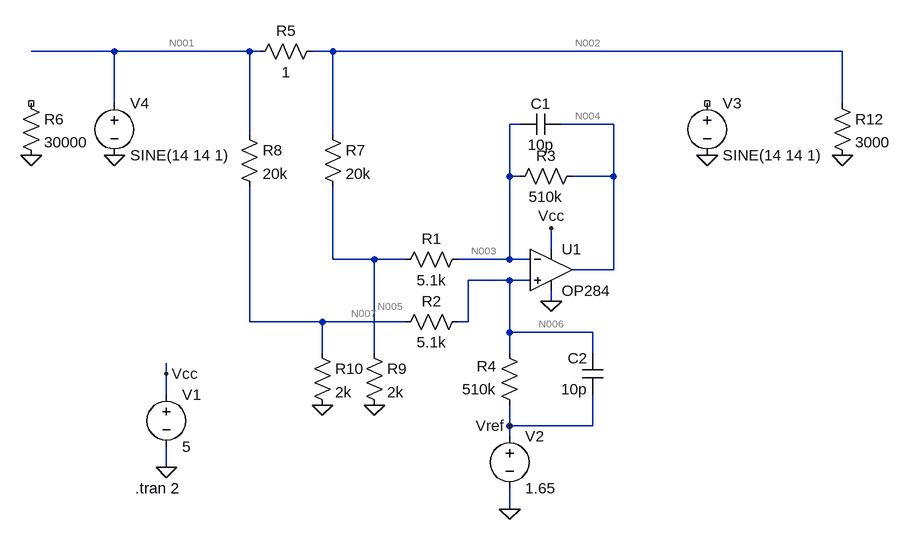
[diagram p0: schematic Diff_OAMP_0.asc]
Diff_OAMP_0.asc, the LTspice schematic file:
Version 4
SHEET 1 884 680
WIRE -464 -176 -592 -176
WIRE -256 -176 -464 -176
WIRE -240 -176 -256 -176
WIRE -128 -176 -160 -176
WIRE 656 -176 -128 -176
WIRE -464 -96 -464 -176
WIRE 656 -96 656 -176
WIRE 160 -64 144 -64
WIRE 304 -64 224 -64
WIRE -256 -48 -256 -176
WIRE -128 -48 -128 -176
WIRE 144 16 144 -64
WIRE 160 16 144 16
WIRE 304 16 304 -64
WIRE 304 16 240 16
WIRE 208 128 208 96
WIRE -128 144 -128 32
WIRE -64 144 -128 144
WIRE -16 144 -64 144
WIRE 144 144 144 16
WIRE 144 144 64 144
WIRE 176 144 144 144
WIRE 304 160 304 16
WIRE 304 160 240 160
WIRE 144 176 80 176
WIRE 176 176 144 176
WIRE 208 208 208 192
WIRE -256 240 -256 32
WIRE -144 240 -256 240
WIRE -16 240 -144 240
WIRE 80 240 80 176
WIRE 80 240 64 240
WIRE 144 256 144 176
WIRE 272 256 144 256
WIRE -144 288 -144 240
WIRE -64 288 -64 144
WIRE 144 288 144 256
WIRE 272 288 272 256
WIRE -384 320 -384 304
WIRE -384 352 -384 320
WIRE 144 400 144 368
WIRE 272 400 272 352
WIRE 272 400 144 400
WIRE 144 416 144 400
WIRE -384 464 -384 432
WIRE 144 528 144 496
FLAG 208 208 0
FLAG 208 96 Vcc
FLAG -384 464 0
FLAG 144 528 0
FLAG -384 320 Vcc
FLAG 144 400 Vref
FLAG 448 -16 0
FLAG -592 -16 0
FLAG -144 368 0
FLAG -64 368 0
FLAG 656 -16 0
FLAG -464 -16 0
SYMBOL Opamps\\OP284 208 96 R0
SYMATTR InstName U1
SYMBOL res 80 128 R90
WINDOW 0 0 56 VBottom 2
WINDOW 3 32 56 VTop 2
SYMATTR InstName R1
SYMATTR Value 5.1k
SYMBOL res 80 224 R90
WINDOW 0 0 56 VBottom 2
WINDOW 3 32 56 VTop 2
SYMATTR InstName R2
SYMATTR Value 5.1k
SYMBOL res 256 0 R90
WINDOW 0 0 56 VBottom 2
WINDOW 3 32 56 VTop 2
SYMATTR InstName R3
SYMATTR Value 510k
SYMBOL res 160 384 R180
WINDOW 0 36 76 Left 2
WINDOW 3 36 40 Left 2
SYMATTR InstName R4
SYMATTR Value 510k
SYMBOL voltage -384 336 R0
WINDOW 123 0 0 Left 0
WINDOW 39 0 0 Left 0
SYMATTR InstName V1
SYMATTR Value 5
SYMBOL voltage 144 400 R0
WINDOW 123 0 0 Left 0
WINDOW 39 0 0 Left 0
SYMATTR InstName V2
SYMATTR Value 1.65
SYMBOL res -144 -192 R90
WINDOW 0 0 56 VBottom 2
WINDOW 3 32 56 VTop 2
SYMATTR InstName R5
SYMATTR Value 1
SYMBOL voltage 448 -112 R0
WINDOW 123 0 0 Left 0
WINDOW 39 0 0 Left 0
SYMATTR InstName V3
SYMATTR Value SINE(14 14 1)
SYMBOL res -608 -112 R0
SYMATTR InstName R6
SYMATTR Value 30000
SYMBOL res -144 -64 R0
SYMATTR InstName R7
SYMATTR Value 20k
SYMBOL res -272 -64 R0
SYMATTR InstName R8
SYMATTR Value 20k
SYMBOL res -80 272 R0
SYMATTR InstName R9
SYMATTR Value 2k
SYMBOL res -160 272 R0
SYMATTR InstName R10
SYMATTR Value 2k
SYMBOL cap 224 -80 R90
WINDOW 0 0 32 VBottom 2
WINDOW 3 32 32 VTop 2
SYMATTR InstName C1
SYMATTR Value 10p
SYMBOL cap 288 352 R180
WINDOW 0 24 56 Left 2
WINDOW 3 24 8 Left 2
SYMATTR InstName C2
SYMATTR Value 10p
SYMBOL res 640 -112 R0
SYMATTR InstName R12
SYMATTR Value 3000
SYMBOL voltage -464 -112 R0
WINDOW 123 0 0 Left 0
WINDOW 39 0 0 Left 0
SYMATTR InstName V4
SYMATTR Value SINE(14 14 1)
TEXT -432 496 Left 2 !.tran 2

The netlist it stands for:
* Diff_OAMP_0.asc
XU1 N006 N003 Vcc 0 N004 OP284  ; pins In+ In- V+ V- OUT
R1 N003 N005 5.1k
R2 N006 N007 5.1k
R3 N004 N003 510k
R4 Vref N006 510k
V1 Vcc 0 5
V2 Vref 0 1.65
R5 N002 N001 1
V3 NC_01 0 SINE(14 14 1)
R6 NC_02 0 30000
R7 N002 N005 20k
R8 N001 N007 20k
R9 N005 0 2k
R10 N007 0 2k
C1 N004 N003 10p
C2 Vref N006 10p
R12 N002 0 3000
V4 N001 0 SINE(14 14 1)
.tran 2
.lib ADI1.lib
.backanno
.end

* Results of the author's LTspice run, read from the files saved beside the schematic
* Operating Point, zero values left out:
*   V(n003) = 1.278 V
*   V(vcc) = 5 V
*   V(n006) = 1.278 V
*   V(n004) = 1.692 V
*   V(n005) = 1.274 V
*   V(n007) = 1.274 V
*   V(vref) = 1.65 V
*   V(n002) = 13.99 V
*   V(n001) = 14 V
*   I(R12) = 4.665 mA
*   I(R10) = 637.1 µA
*   I(R9) = 636.9 µA
*   I(R8) = 636.3 µA
*   I(R7) = 636 µA
*   I(R5) = -5.301 mA
*   I(R4) = 728.8 nA
*   I(R3) = 811.9 nA
*   I(R2) = 808.8 nA
*   I(R1) = 881.9 nA
*   I(V4) = -5.937 mA
*   I(V2) = -728.8 nA
*   I(V1) = -1 mA
*   Ix(u1:1) = -80.03 nA
*   Ix(u1:2) = -70.03 nA
*   Ix(u1:99) = 1 mA
*   Ix(u1:50) = -999.2 µA
*   Ix(u1:45) = -811.9 nA
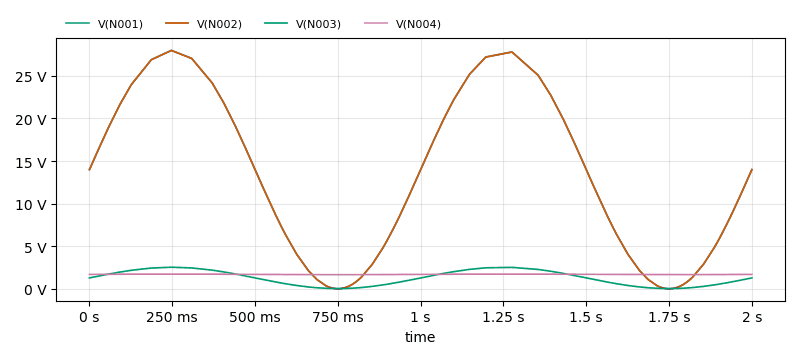
[diagram p1: Transient Analysis of Diff_OAMP_0.asc, plotted from the saved traces]
* Transient Analysis, 1 run:
*   V(N001): min 163.8 µV, max 28 V, average 13.96 V, rms 17.09 V, last 14 V
*   V(N002): min 691 µV, max 27.99 V, average 13.95 V, rms 17.08 V, last 13.99 V
*   V(N003): min 24.17 mV, max 2.534 V, average 1.275 V, rms 1.552 V, last 1.278 V
*   V(N004): min 1.657 V, max 1.728 V, average 1.692 V, rms 1.692 V, last 1.692 V